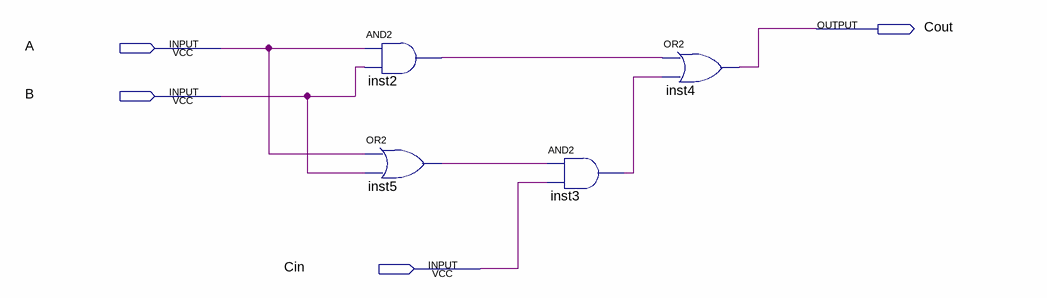
[diagram p0: schematic sheet]
// Quartus schematic Block2.bdf as structural Verilog: 4 symbols, 4 pins
module Block2 (
  input  A,
  input  B,
  input  Cin,
  output Cout
);

  wire inst2_out, inst3_out, inst5_out;

  and inst2 (inst2_out, A, B);
  or inst5 (inst5_out, A, B);
  and inst3 (inst3_out, inst5_out, Cin);
  or inst4 (Cout, inst2_out, inst3_out);
endmodule
